# EAGLE design week7-small (EAGLE 8.6.0)
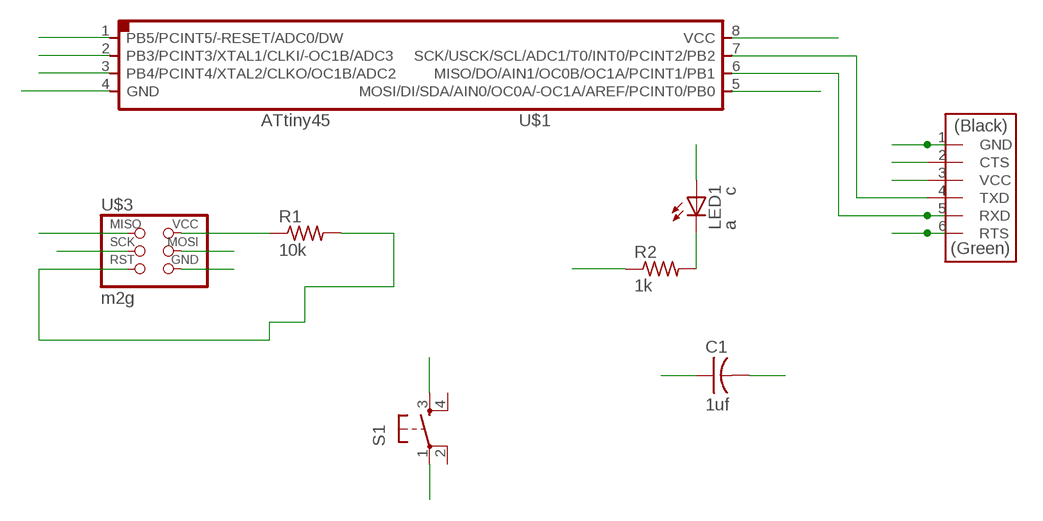
[diagram p0: schematic, sheet 1]

## Parts
C1  1uf  CAP-US1206FAB  [C1206FAB]
LED1  a c  LEDFAB1206  [LED1206FAB]
R1  10k  RES-US1206FAB  [R1206FAB]
R2  1k  RES-US1206FAB  [R1206FAB]
S1  6MM_SWITCH6MM_SWITCH  [6MM_SWITCH]
U$1  tt45  ATTINY45SI  [SOIC8]
U$3  m2g  AVRISPSMD  [2X03SMD]
U$4  FTDI-SMD-HEADER  [1X06SMD]

## Nets
GND: C1.2 R2.1 S1.3(S) U$1.4(GND) U$3.6(GND) U$4.1(GND)
MISO: U$1.6(MISO/DO/AIN1/OC0B/OC1A/PCINT1/PB1) U$3.1(MISO) U$4.5(RXD)
MOSI: U$1.5(MOSI/DI/SDA/AIN0/OC0A/-OC1A/AREF/PCINT0/PB0) U$3.4(MOSI)
N$1: LED1.2(C) R2.2
N$23: U$4.2(CTS)
N$27: U$4.6(RTS)
RST: R1.2 U$1.1(PB5/PCINT5/-RESET/ADC0/DW) U$3.5(RST)
SCK: U$1.7(SCK/USCK/SCL/ADC1/T0/INT0/PCINT2/PB2) U$3.3(SCK) U$4.4(TXD)
VCC: C1.1 R1.1 U$1.8(VCC) U$3.2(VCC) U$4.3(VCC)
XTAL1: LED1.1(A) U$1.2(PB3/PCINT3/XTAL1/CLKI/-OC1B/ADC3)
XTAL2: S1.1(P) U$1.3(PB4/PCINT4/XTAL2/CLKO/OC1B/ADC2)
Unconnected: S1.2(P1) S1.4(S1)

## Library data of the parts
C1 = fab:CAP-US
LED1 = fab:LED: LED
R1 R2 = fab:RES-US: Resistor (US Symbol) Variants with postfix FAB are widened to allow the routing of internal traces
S1 = fab:6MM_SWITCH: OMRON SWITCH
U$1 = fab:ATTINY45
U$3 = fab:AVRISP
U$4 = fab:FTDI-SMD-HEADER

## Net classes
0 default: width 0.4 mm, drill 0.4 mm, clearance 0.4 mm

## Board
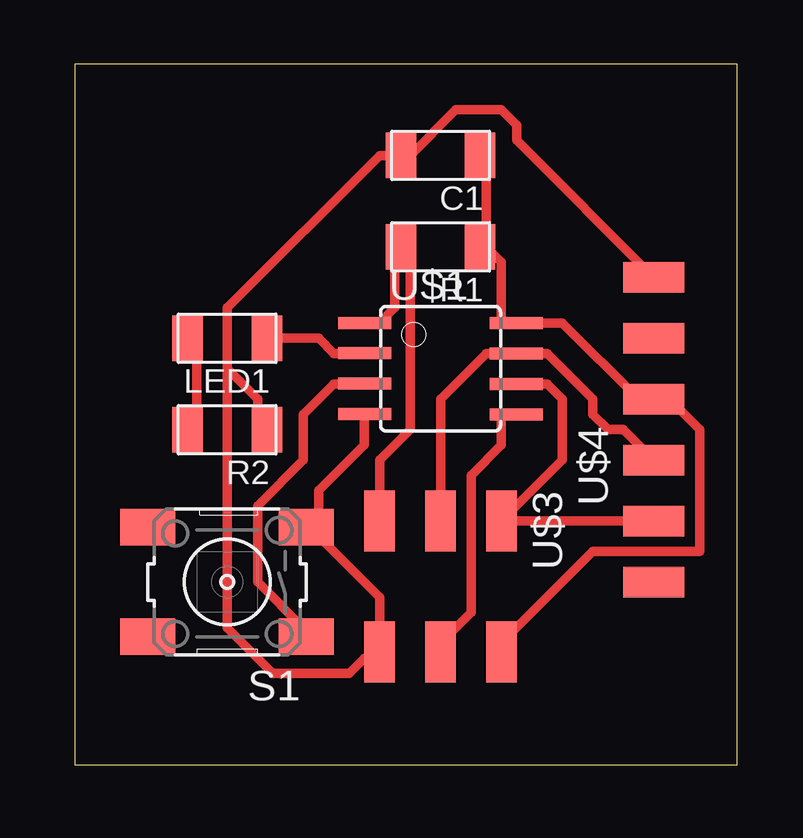
[diagram p1: board, top side]
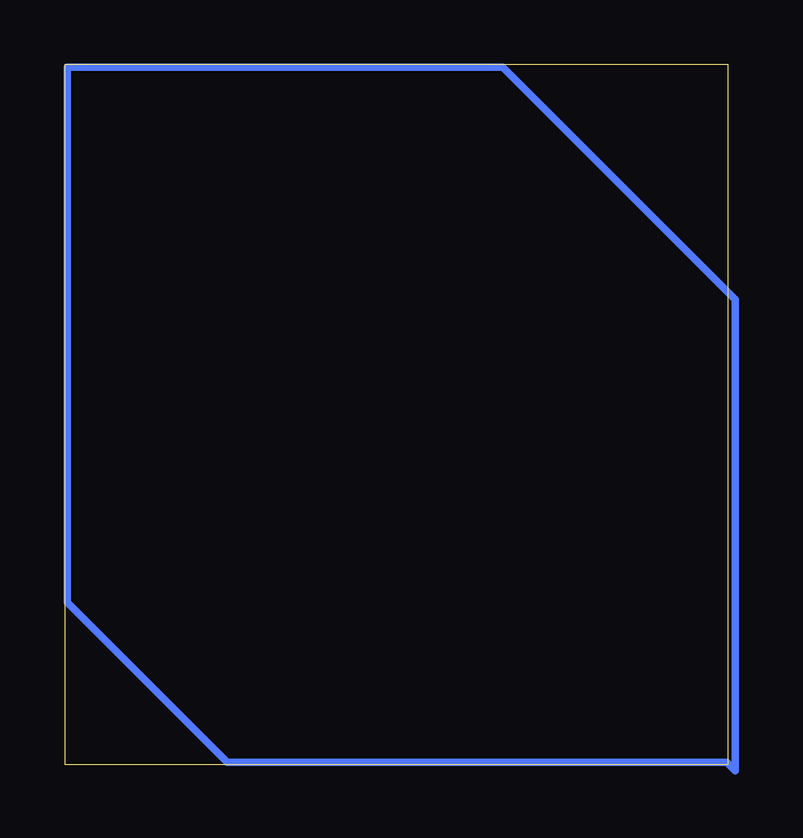
[diagram p2: board, bottom side, seen from below]

Size 27.61 x 29.2 mm. Coordinates in mm from the lower left corner, seen from the top.
Outline: 0,0 27.61,0 27.61,29.2 0,29.2 0,0
Copper layers (1*16): Top 0.035mm / dielectric 1.5mm / Bottom 0.035mm
Design rules "default": minimum track width 6mil, minimum drill 0.35mm, track to track 6mil, track to pad 6mil, pad to pad 6mil, via to via 6mil, smd to smd 6mil, copper to edge 40mil, drill to drill 6mil, minimum pad ring 10mil, minimum via ring 8mil, stop-mask expansion 4mil, vias tented up to drill 0mil, thermal gap 10mil

### Footprints (pad centres in the part's own frame; a part is rotated, then mirrored left to right if it is on the bottom)
C1206FAB = smd 1.27 x 1.905: 1 -1.651,0; 2 1.651,0
LED1206FAB = smd 1.27 x 1.905: 1 -1.651,0; 2 1.651,0
R1206FAB = smd 1.27 x 1.905: 1 -1.651,0; 2 1.651,0
6MM_SWITCH = smd 2.286 x 1.524: 1 -3.302,2.286; 2 3.302,2.286; 3 -3.302,-2.286; 4 3.302,-2.286
SOIC8 = smd 0.5 x 2.2: 1 -1.905,-3.154; 2 -0.645,-3.154; 3 0.625,-3.154; 4 1.895,-3.154; 5 1.905,3.154; 6 0.635,3.154; 7 -0.635,3.154; 8 -1.905,3.154
2X03SMD = smd 2.54 x 1.27: 1 -2.54,2.54; 2 2.92,2.54; 3 -2.54,0; 4 2.92,0; 5 -2.54,-2.54; 6 2.92,-2.54
1X06SMD = smd 2.54 x 1.27: 1 0,6.35; 2 0,3.81; 3 0,1.27; 4 0,-1.27; 5 0,-3.81; 6 0,-6.35

### Placement (x,y rotation side)
C1  15.24,25.4 180 top
LED1  6.35,17.78 180 top
R1  15.24,21.59 180 top
R2  6.35,13.97 180 top
S1  6.35,7.62 180 top
U$1  15.24,16.51 270 top
U$3  15.24,7.62 270 top
U$4  24.13,13.97 0 top

### Tracks (layer width: path | path; a pad name or v marks a point on that pad's centre or on a via)
GND
  Top 0.4: U$1.4 12.07,14.6 12.07,13.33 10.16,11.43 10.16,10.16 S1.3 10.16,9.52 12.7,6.98 U$3.6 12.7,4.44 12.07,4.44 11.43,3.81 8.25,3.81 6.35,5.71 6.35,16.51 | 6.35,16.51 7.62,15.24 7.62,13.97 R2.1 | 6.35,16.51 6.35,19.05 12.7,25.4 C1.2 13.97,25.4 15.88,27.3 17.78,27.3 18.42,26.67 18.42,26.04 U$4.1
MISO
  Top 0.4: U$1.6 19.68,15.87 20.32,15.24 20.32,12.7 U$3.1 U$4.5
MOSI
  Top 0.4: U$1.5 17.78,14.6 17.78,13.33 16.51,12.06 16.51,6.35 15.24,5.08 U$3.4
N$1
  Top 0.4: R2.2 5.08,13.97 5.08,17.78 LED1.2
N$2
  Bottom 0.305: 0.04,19.74 9.38,29.08 27.52,29.08 27.52,6.78 20.85,0.11 0.04,0.11 -0.31,-0.24 -0.31,19.39 0.35,20.05
RST
  Top 0.4: U$1.1 12.7,18.41 13.34,19.05 13.34,21.59 R1.2 13.97,21.59 13.97,13.97 12.7,12.7 U$3.5
SCK
  Top 0.4: U$3.3 15.24,15.24 17.14,17.14 U$1.7 19.68,17.14 21.59,15.24 21.59,14.6 22.22,13.97 22.86,13.97 U$4.4
VCC
  Top 0.4: 17.14,21.59 17.14,25.4 C1.1 | 17.14,21.59 17.78,20.96 17.78,18.41 U$1.8 20.32,18.41 23.5,15.24 U$4.3 24.77,15.24 26.04,13.97 26.04,8.89 21.59,8.89 17.78,5.08 U$3.2 | 17.14,21.59 R1.1
XTAL1
  Top 0.4: LED1.1 10.16,17.78 10.79,17.14 12.07,17.14 U$1.2
XTAL2
  Top 0.4: U$1.3 12.07,15.87 10.79,15.87 9.53,14.6 9.53,12.7 7.62,10.79 7.62,7.62 9.53,5.71 S1.1